# Altium schematic sheet RadioRepeater.SchDoc
size A3; CompanyName: KDS; Organization: KDS; DocumentNumber: 8; Revision: V1I1; SheetNumber: 8; SheetTotal: 8; PageSetup: Record=PageOptions|CenterHorizontal=True|CenterVertical=True|PrintScale=1.07|XCorrection=1.00|YCorrection=1.00|PrintKind=1|BorderSize=5000000|LeftOffset=0|BottomOffset=0|Orientation=2|PaperLength=1000|PaperWidth=1000|Scale=100|PaperSource=7|PrintQuality=600|MediaType=1|DitherType=10|PaperKind=A3|PrintScaleMode=1; ProjectName: KDS C6A816x Module
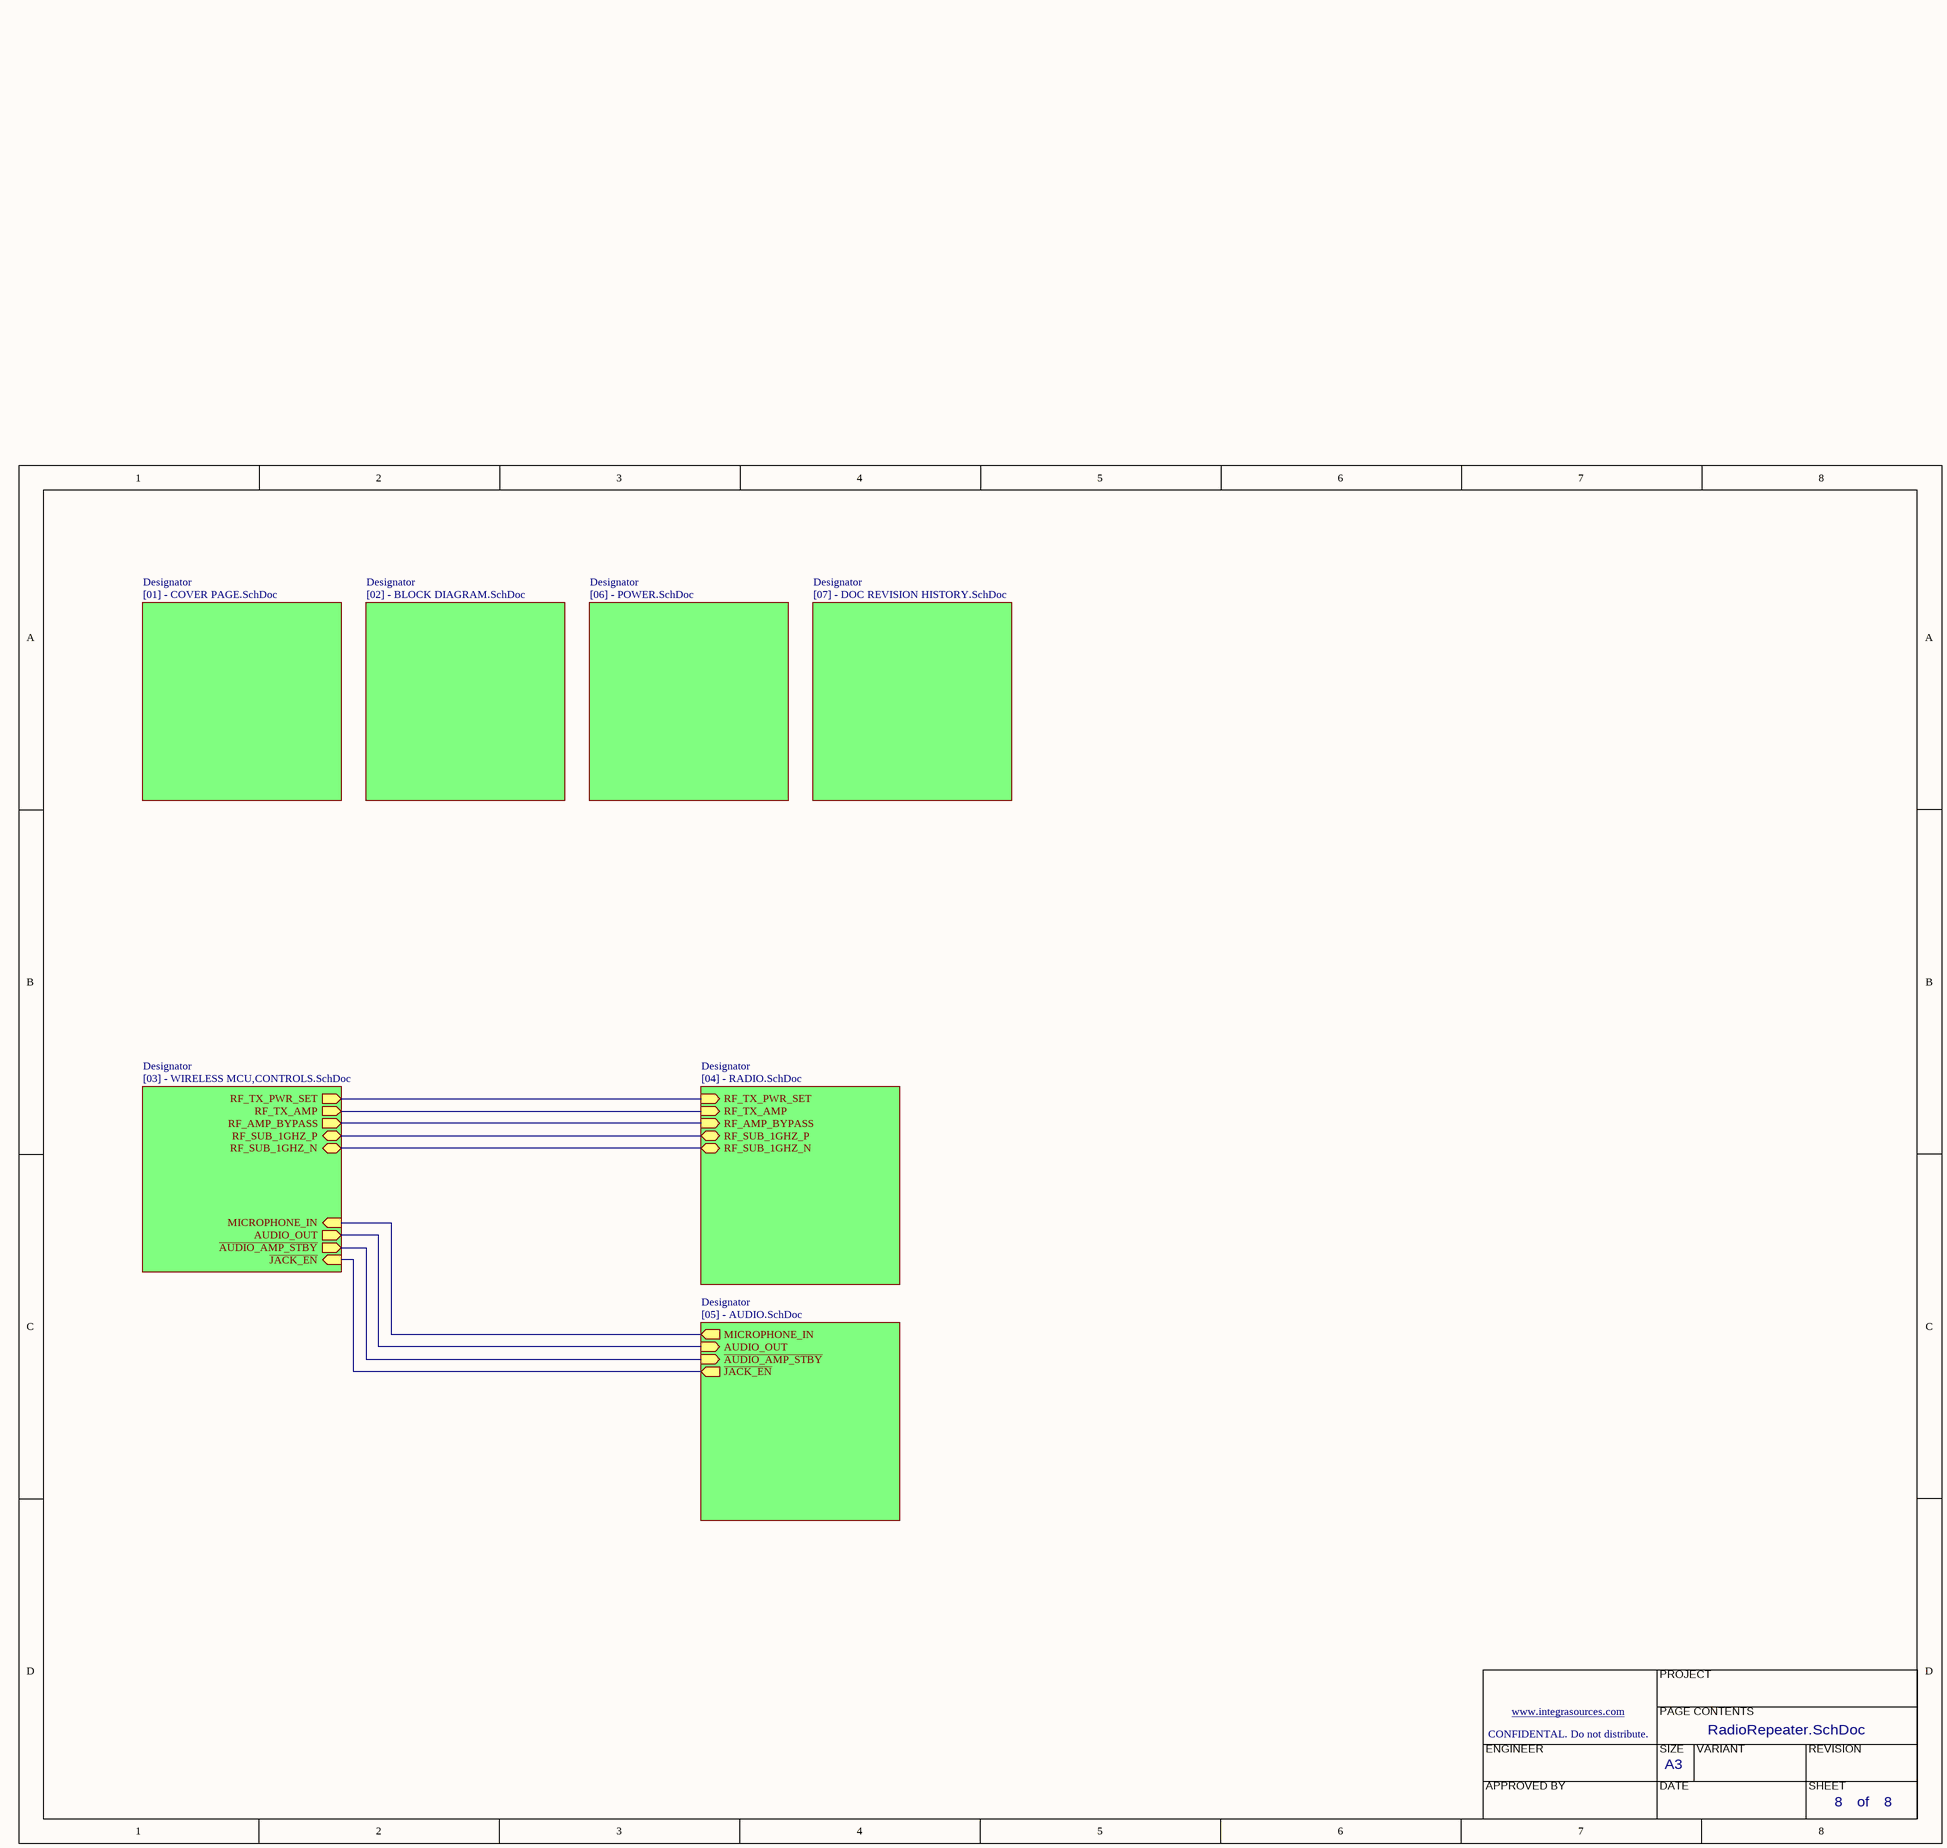
[diagram p0: RadioRepeater.SchDoc]

## Sub-sheets
Designator = [01] - COVER PAGE.SchDoc: no entries
Designator = [02] - BLOCK DIAGRAM.SchDoc: no entries
Designator = [07] - DOC REVISION HISTORY.SchDoc: no entries
Designator = [03] - WIRELESS MCU,CONTROLS.SchDoc: RF_TX_AMP (out), RF_AMP_BYPASS (out), RF_TX_PWR_SET (out), MICROPHONE_IN (in), AUDIO_OUT (out), ~{AUDIO_AMP_STBY} (out), ~{JACK_EN} (in), RF_SUB_1GHZ_P (bidir), RF_SUB_1GHZ_N (bidir)
Designator = [04] - RADIO.SchDoc: RF_TX_PWR_SET (in), RF_TX_AMP (in), RF_AMP_BYPASS (in), RF_SUB_1GHZ_P (bidir), RF_SUB_1GHZ_N (bidir)
Designator = [05] - AUDIO.SchDoc: MICROPHONE_IN (out), AUDIO_OUT (in), ~{AUDIO_AMP_STBY} (in), ~{JACK_EN} (out)
Designator = [06] - POWER.SchDoc: no entries

## Nets
(unnamed): sheet Designator/RF_TX_AMP, sheet Designator/RF_TX_AMP
(unnamed): sheet Designator/RF_AMP_BYPASS, sheet Designator/RF_AMP_BYPASS
(unnamed): sheet Designator/RF_TX_PWR_SET, sheet Designator/RF_TX_PWR_SET
(unnamed): sheet Designator/MICROPHONE_IN, sheet Designator/MICROPHONE_IN
(unnamed): sheet Designator/AUDIO_OUT, sheet Designator/AUDIO_OUT
(unnamed): sheet Designator/~{AUDIO_AMP_STBY}, sheet Designator/~{AUDIO_AMP_STBY}
(unnamed): sheet Designator/~{JACK_EN}, sheet Designator/~{JACK_EN}
(unnamed): sheet Designator/RF_SUB_1GHZ_P, sheet Designator/RF_SUB_1GHZ_P
(unnamed): sheet Designator/RF_SUB_1GHZ_N, sheet Designator/RF_SUB_1GHZ_N

## Notes on the sheet
- PROJECT
- CONFIDENTAL. Do not distribute.
- www.integrasources.com
- PAGE CONTENTS
- ENGINEER
- APPROVED BY
- SIZE
- DATE
- A3
- VARIANT
- REVISION
- SHEET
- of